# Altium schematic sheet MCU.SchDoc
size A4 portrait
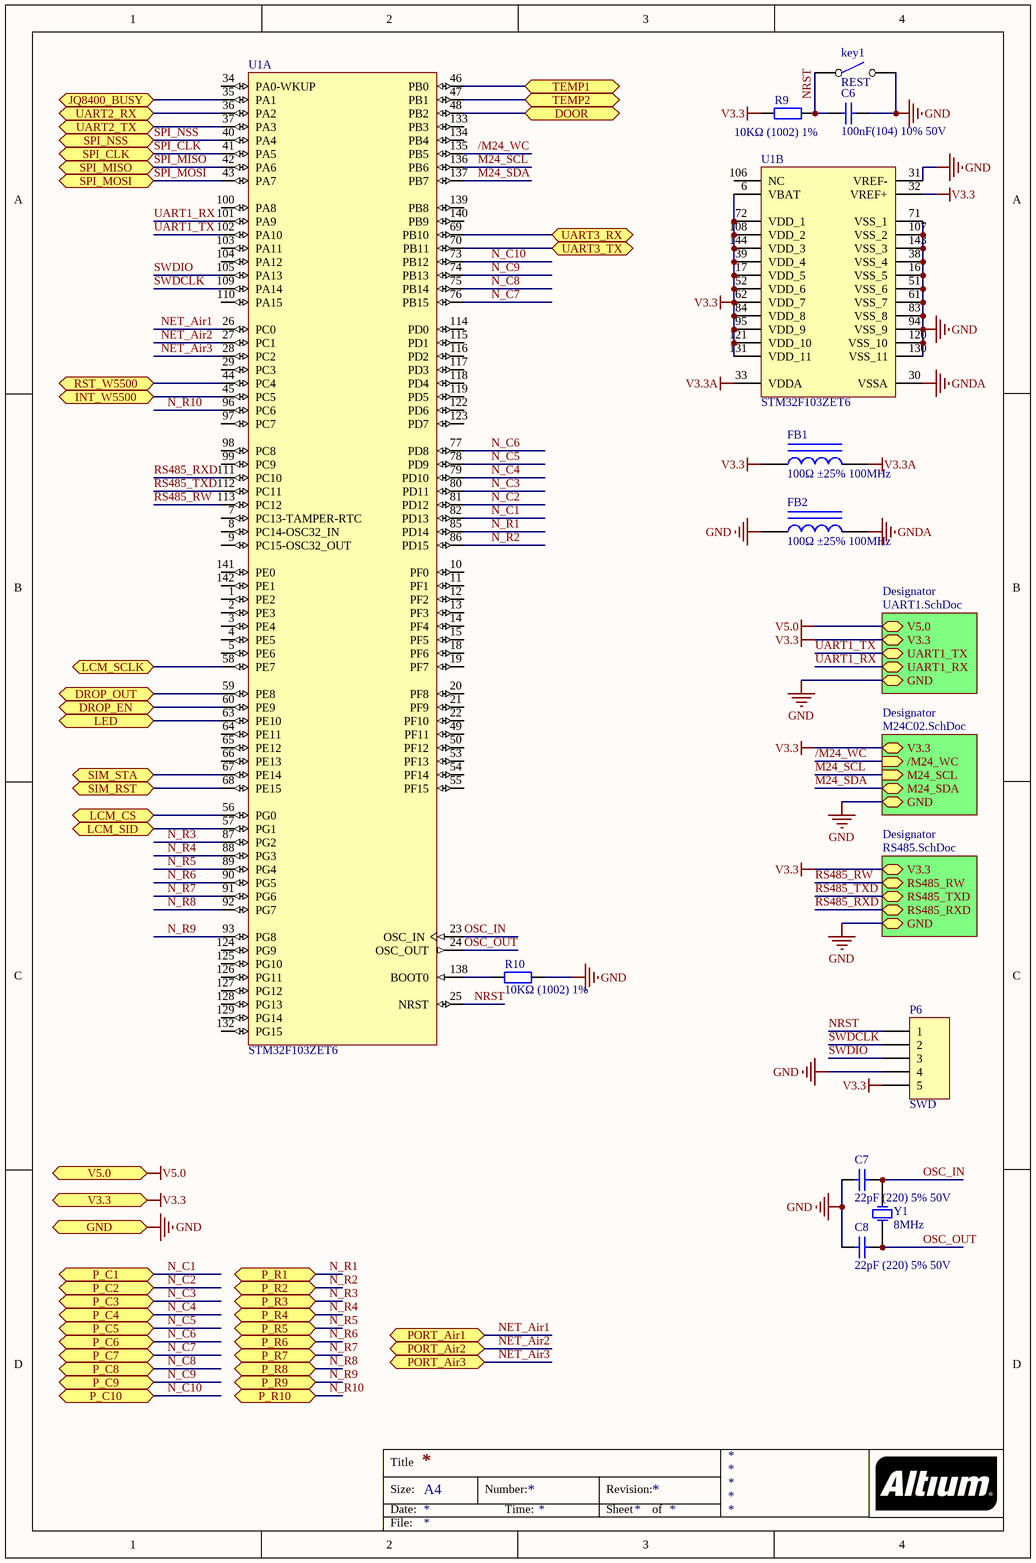
[diagram p0: MCU.SchDoc]

## Parts
C6  100nF(104) 10% 50V  [0805_C]
C7  22pF (220) 5% 50V  [0805_C]
C8  22pF (220) 5% 50V  [0805_C]
FB1  100Ω ±25% 100MHz  [0805_L]
FB2  100Ω ±25% 100MHz  [0805_L]
key1  REST  [key]
P6  SWD  [HDR1X5]
R9  10KΩ (1002) 1%  [0805_R]
R10  10KΩ (1002) 1%  [0805_R]
U1  STM32F103ZET6  [LQFP-144_20x20x05P]  (parts A,B of 2)
Y1  8MHz  [SMD-5032_2P]

## Sub-sheets
Designator = UART1.SchDoc: V5.0, GND, V3.3, UART1_TX, UART1_RX
Designator = M24C02.SchDoc: V3.3, GND, M24_SDA, /M24_WC (in), M24_SCL (in)
Designator = RS485.SchDoc: GND, V3.3, RS485_RW, RS485_TXD, RS485_RXD

## Ports
DOOR, DROP_EN, DROP_OUT, GND, INT_W5500, JQ8400_BUSY, LCM_CS, LCM_SCLK, LCM_SID, LED, P_C1, P_C2, P_C3, P_C4, P_C5, P_C6, P_C7, P_C8, P_C9, P_C10, P_R1, P_R2, P_R3, P_R4, P_R5, P_R6, P_R7, P_R8, P_R9, P_R10, PORT_Air1, PORT_Air2, PORT_Air3, RST_W5500, SIM_RST, SIM_STA, SPI_CLK, SPI_MISO, SPI_MOSI, SPI_NSS, TEMP1, TEMP2, UART2_RX, UART2_TX, UART3_RX, UART3_TX, V3.3, V5.0

## Nets
GND: C6.2 C7.2 C8.2 FB2.1 key1.2 P6.4 R10.2 U1.16(VSS_5) U1.31(VREF-) U1.38(VSS_4) U1.51(VSS_6) U1.61(VSS_7) U1.71(VSS_1) U1.83(VSS_8) U1.94(VSS_9) U1.107(VSS_2) U1.120(VSS_10) U1.130(VSS_11) U1.143(VSS_3) ; port GND, sheet Designator/GND, sheet Designator/GND, sheet Designator/GND
GNDA: FB2.2 U1.30(VSSA)
V3.3: FB1.1 P6.5 R9.2 U1.6(VBAT) U1.17(VDD_5) U1.32(VREF+) U1.39(VDD_4) U1.52(VDD_6) U1.62(VDD_7) U1.72(VDD_1) U1.84(VDD_8) U1.95(VDD_9) U1.108(VDD_2) U1.121(VDD_10) U1.131(VDD_11) U1.144(VDD_3) ; port V3.3, sheet Designator/V3.3, sheet Designator/V3.3, sheet Designator/V3.3
V3.3A: FB1.2 U1.33(VDDA)
V5.0: port V5.0, sheet Designator/V5.0
/M24_WC: U1.135(PB5) ; sheet Designator//M24_WC
DOOR: U1.48(PB2) ; port DOOR
DROP_EN: U1.60(PE9) ; port DROP_EN
DROP_OUT: U1.59(PE8) ; port DROP_OUT
INT_W5500: U1.45(PC5) ; port INT_W5500
JQ8400_BUSY: U1.35(PA1) ; port JQ8400_BUSY
LCM_CS: U1.56(PG0) ; port LCM_CS
LCM_SCLK: U1.58(PE7) ; port LCM_SCLK
LCM_SID: U1.57(PG1) ; port LCM_SID
LED: U1.63(PE10) ; port LED
M24_SCL: U1.136(PB6) ; sheet Designator/M24_SCL
M24_SDA: U1.137(PB7) ; sheet Designator/M24_SDA
N_C1: U1.82(PD13) ; port P_C1
N_C2: U1.81(PD12) ; port P_C2
N_C3: U1.80(PD11) ; port P_C3
N_C4: U1.79(PD10) ; port P_C4
N_C5: U1.78(PD9) ; port P_C5
N_C6: U1.77(PD8) ; port P_C6
N_C7: U1.76(PB15) ; port P_C7
N_C8: U1.75(PB14) ; port P_C8
N_C9: U1.74(PB13) ; port P_C9
N_C10: U1.73(PB12) ; port P_C10
N_R1: U1.85(PD14) ; port P_R1
N_R2: U1.86(PD15) ; port P_R2
N_R3: U1.87(PG2) ; port P_R3
N_R4: U1.88(PG3) ; port P_R4
N_R5: U1.89(PG4) ; port P_R5
N_R6: U1.90(PG5) ; port P_R6
N_R7: U1.91(PG6) ; port P_R7
N_R8: U1.92(PG7) ; port P_R8
N_R9: U1.93(PG8) ; port P_R9
N_R10: U1.96(PC6) ; port P_R10
NET_Air1: U1.26(PC0) ; port PORT_Air1
NET_Air2: U1.27(PC1) ; port PORT_Air2
NET_Air3: U1.28(PC2) ; port PORT_Air3
NRST: C6.1 key1.1 P6.1 R9.1 U1.25(NRST)
OSC_IN: C7.1 U1.23(OSC_IN) Y1.1(OSC1)
OSC_OUT: C8.1 U1.24(OSC_OUT) Y1.2(OSC2)
RS485_RW: U1.113(PC12) ; sheet Designator/RS485_RW
RS485_RXD: U1.111(PC10) ; sheet Designator/RS485_RXD
RS485_TXD: U1.112(PC11) ; sheet Designator/RS485_TXD
RST_W5500: U1.44(PC4) ; port RST_W5500
SIM_RST: U1.68(PE15) ; port SIM_RST
SIM_STA: U1.67(PE14) ; port SIM_STA
SPI_CLK: U1.41(PA5) ; port SPI_CLK
SPI_MISO: U1.42(PA6) ; port SPI_MISO
SPI_MOSI: U1.43(PA7) ; port SPI_MOSI
SPI_NSS: U1.40(PA4) ; port SPI_NSS
SWDCLK: P6.2 U1.109(PA14)
SWDIO: P6.3 U1.105(PA13)
TEMP1: U1.46(PB0) ; port TEMP1
TEMP2: U1.47(PB1) ; port TEMP2
UART1_RX: U1.101(PA9) ; sheet Designator/UART1_RX
UART1_TX: U1.102(PA10) ; sheet Designator/UART1_TX
UART2_RX: U1.36(PA2) ; port UART2_RX
UART2_TX: U1.37(PA3) ; port UART2_TX
UART3_RX: U1.69(PB10) ; port UART3_RX
UART3_TX: U1.70(PB11) ; port UART3_TX
NetR10_1: R10.1 U1.138(BOOT0)

Not connected (* = marked no-connect by the designer): U1 1(PE2) 2(PE3) 3(PE4) 4(PE5) 5(PE6) 7(PC13-TAMPER-RTC) 8(PC14-OSC32_IN) 9(PC15-OSC32_OUT) 10(PF0) 11(PF1) 12(PF2) 13(PF3) 14(PF4) 15(PF5) 18(PF6) 19(PF7) 20(PF8) 21(PF9) 22(PF10) 29(PC3) 34(PA0-WKUP) 49(PF11) 50(PF12) 53(PF13) 54(PF14) 55(PF15) 64(PE11) 65(PE12) 66(PE13) 97(PC7) 98(PC8) 99(PC9) 100(PA8) 103(PA11) 104(PA12) 106(NC) 110(PA15) 114(PD0) 115(PD1) 116(PD2) 117(PD3) 118(PD4) 119(PD5) 122(PD6) 123(PD7) 124(PG9) 125(PG10) 126(PG11) 127(PG12) 128(PG13) 129(PG14) 132(PG15) 133(PB3) 134(PB4) 139(PB8) 140(PB9) 141(PE0) 142(PE1)

## Notes on the sheet
- Title
- Size:
- Date:
- A4
- Number:
- Time:
- Revision:
- Sheet
- of
- File:

## Library data of the parts
C6 = 0805 100nF(104) 10% 50V: 贴片电容; ComponentLink1Description: 供应商链接; ComponentLink1URL: http://www.szlcsc.com/product/details_50686.html; Package: 0805; Supplier: LC; SuppliersPartNumber: C49678
C7 C8 = 0805 22pF (220) 5% 50V: 贴片电容; ComponentLink1Description: 供应商链接; ComponentLink1URL: http://www.szlcsc.com/product/details_2156.html; Package: 0805; Supplier: LC; SuppliersPartNumber: C1804
FB1 FB2 = 0805 100Ω 25% 100MHz: 贴片磁珠; ComponentLink1Description: 供应商链接; ComponentLink1URL: http://www.szlcsc.com/product/details_1367.html; Package: 0805; Supplier: LC; SuppliersPartNumber: C1015
key1 = 单刀开关
P6 = Header 5: Header, 5-Pin; LatestRevisionDate: 17-Jul-2002; LatestRevisionNote: Re-released for DXP Platform.; Publisher: Altium Limited
R9 R10 = 0805 10KΩ (1002) 1%: 贴片电阻; ComponentLink1Description: 供应商链接; ComponentLink1URL: http://www.szlcsc.com/product/details_18102.html; Package: 0805; Supplier: LC; SuppliersPartNumber: C17414
U1 = STM32F103ZET6: ARM; ComponentLink1Description: 供应商链接; ComponentLink1URL: http://www.szlcsc.com/product/details_8779.html; Package: LQFP-144_20x20x05P; Supplier: LC; SuppliersPartNumber: C8287
Y1 = SMD-5032_2P 8MHz 20ppm 20pF: 贴片晶振; ComponentLink1Description: 供应商链接; ComponentLink1URL: http://www.szlcsc.com/product/details_117214.html; Package: SMD-5032_2P; Supplier: LC; SuppliersPartNumber: C115962